# Altium schematic sheet MCU.SchDoc
size A4; DocumentNumber: 2; SheetNumber: 2; SheetTotal: 3
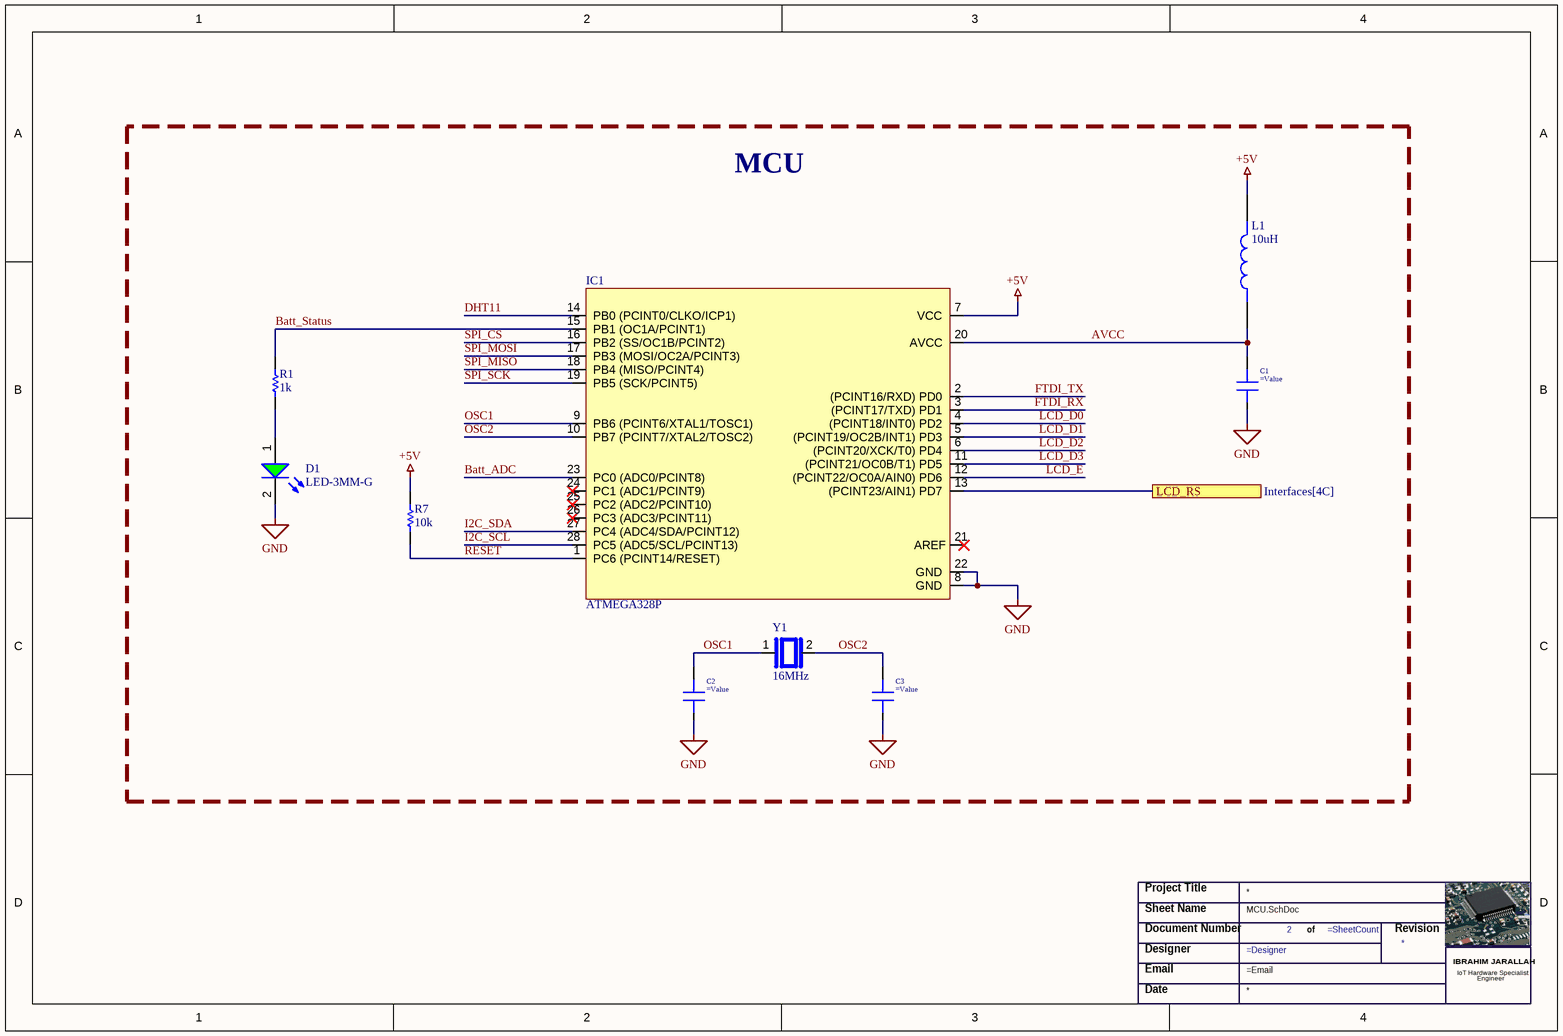
[diagram p0: MCU.SchDoc]

## Parts
*  Title_block_Medium  (value not drawn)
C1  (no value)  [C 0805(2012)x0.85]
C2  (no value)  [C 0805(2012)x0.85]
C3  (no value)  [C 0805(2012)x0.85]
D1  LED-3MM-G  [LED-2.54MM-G]
IC1  ATMEGA328P  [DIP28_P2.54mm_7.62mm]
L1  10uH  [IND_LQH31MN100J03L]
R1  1k  [RESC2013X50X30LL20T20]
R7  10k  [RESC2013X50X30LL20T20]
Y1  16MHz  [XTAL_HC49P488W43L1150T466H350]

## Blocks framed on the sheet
MCU: C1-C3 D1 IC1 L1 R1 R7 Y1

## Ports
LCD_RS (see Interfaces[4C])

## Nets
+5V: IC1.7(VCC) L1.2 R7.1
GND: C1.1 C2.1 C3.1 D1.2(K) IC1.8(GND) IC1.22(GND)
AVCC: C1.2 IC1.20(AVCC) L1.1
Batt_ADC: IC1.23(PC0_(ADC0/PCINT8))
Batt_Status: IC1.15(PB1_(OC1A/PCINT1)) R1.1
DHT11: IC1.14(PB0_(PCINT0/CLKO/ICP1))
FTDI_RX: IC1.3((PCINT17/TXD)_PD1)
FTDI_TX: IC1.2((PCINT16/RXD)_PD0)
I2C_SCL: IC1.28(PC5_(ADC5/SCL/PCINT13))
I2C_SDA: IC1.27(PC4_(ADC4/SDA/PCINT12))
LCD_D0: IC1.4((PCINT18/INT0)_PD2)
LCD_D1: IC1.5((PCINT19/OC2B/INT1)_PD3)
LCD_D2: IC1.6((PCINT20/XCK/T0)_PD4)
LCD_D3: IC1.11((PCINT21/OC0B/T1)_PD5)
LCD_E: IC1.12((PCINT22/OC0A/AIN0)_PD6)
LCD_RS: IC1.13((PCINT23/AIN1)_PD7) ; port LCD_RS
OSC1: C2.2 IC1.9(PB6_(PCINT6/XTAL1/TOSC1)) Y1.1
OSC2: C3.2 IC1.10(PB7_(PCINT7/XTAL2/TOSC2)) Y1.2
RESET: IC1.1(PC6_(PCINT14/RESET)) R7.2
SPI_CS: IC1.16(PB2_(SS/OC1B/PCINT2))
SPI_MISO: IC1.18(PB4_(MISO/PCINT4))
SPI_MOSI: IC1.17(PB3_(MOSI/OC2A/PCINT3))
SPI_SCK: IC1.19(PB5_(SCK/PCINT5))
NetD1_1: D1.1(A) R1.2

Not connected (* = marked no-connect by the designer): IC1 21(AREF)* 24(PC1_(ADC1/PCINT9))* 25(PC2_(ADC2/PCINT10))* 26(PC3_(ADC3/PCINT11))*

## Notes on the sheet
- Title:
- Formation Altium Designer Pro
- Sheet Name:
- Designer:
- Start Date:
- Page:
- Contact:
- of
- ct.formationelectronic@gmail.com
- Revision:
- End Date:
- Altium Designer Pro
- Formation
- (in symbol Title_block_Medium) Project Title; Sheet Name; Document Number; of; Revision; Designer; IBRAHIM JARALLAH; Email; IoT Hardware Specialist; Engineer; Date

## Library data of the parts
C1-C3 = C 0805    50V X7R - 0*: SMD 0805     50V X7R 10%; Manufacturer: Samsung; TYPE: Capacitors; Package-mm: 2012; Part Number: *; Mount Type: SMT; Publisher: Hefest; Manufacturer Alternate: *; Part Number Alternate: *; Published: 07.04.2019; Supplier 1: Comet; Supplier 2: *; Supplier 3: *; Supplier Part Number 1: *; Supplier Part Number 2: *; Supplier Part Number 3: *; RoHS: Y; Technology: Ceramic  MLCC; Value 1: *; Value 2: *; Package: 0805; VDC: 50V; TempCo: X7R; Tolerance %: ±10%; VAC: *; ESR Ohm: *; ComponentLink1Description: Datasheet link; ComponentLink1URL: https://store.comet.bg/download-file.php?id=11; Temperature Range: -55°C ~ +125°C; Price: *
IC1 = IC_ATMEGA328P_PDIP: Microcontroller, ATmega328P, 8-bit, PDIP-28 32kB Flash
L1 = LQH31MN100J03L: Wire Wound Ferrite Inductor for General Circuits; MF: {'manufacturer': u'Murata'}; Package: None; Price: None; Value: *; MP: LQH31MN100J03L; Availability: Unavailable
R1 = RES-0805-SMD: Value: 1k
R7 = RES-0805-SMD: Value: 1k
Y1 = HC-49/U-S16000000ABJB: HC49US Series 16 MHz Â±30 ppm 18 pF -20 to +70 Â°C Through Hole AT-CUT Crystal; MF: {'manufacturer': u'Citizen Finedevice'}; Package: None; Price: None; Value: *; MP: HC-49/U-S16000000ABJB; Availability: Unavailable